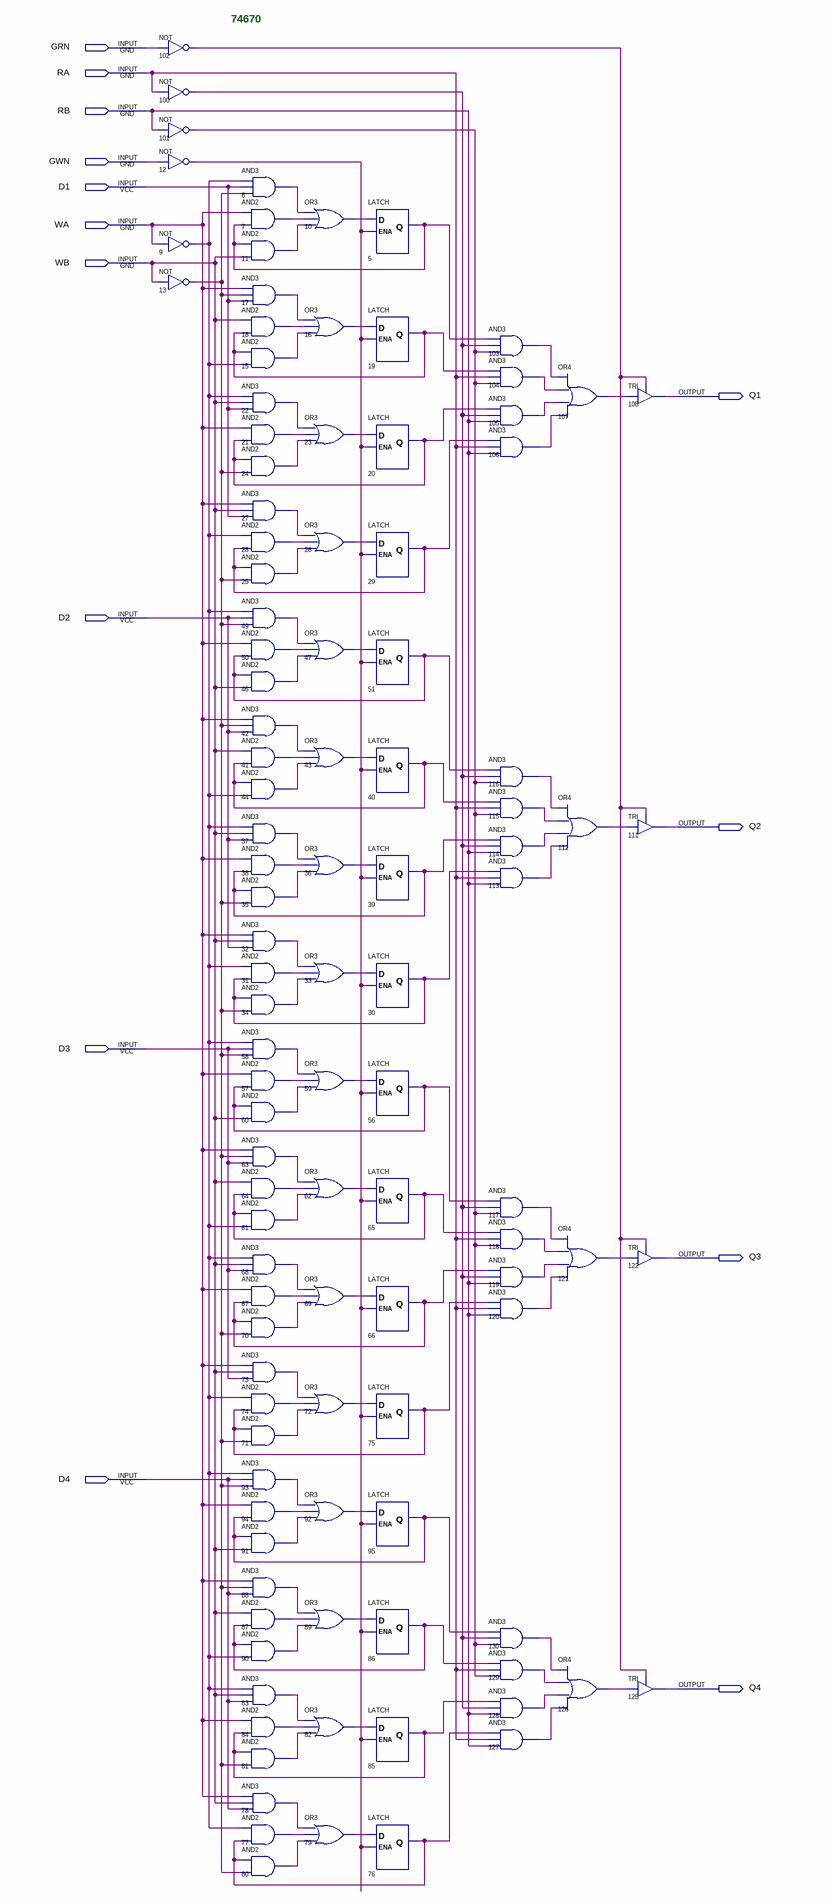
[diagram p0: schematic sheet]
// Quartus schematic 74670.bdf as structural Verilog: 110 symbols, 14 pins
module \74670  (
  input  GRN,
  input  RA,
  input  RB,
  input  GWN,
  input  D1,
  input  WA,
  input  WB,
  input  D2,
  input  D3,
  input  D4,
  output Q1,
  output Q2,
  output Q3,
  output Q4
);

  wire n5_q, n7_out, n8_out, n9_out, n10_out, n11_out, n12_out, n13_out, n15_out, n16_out, n17_out, n18_out,
       n19_q, n20_q, n21_out, n22_out, n23_out, n24_out, n25_out, n26_out, n27_out, n28_out, n29_q, n30_q,
       n31_out, n32_out, n33_out, n34_out, n35_out, n36_out, n37_out, n38_out, n39_q, n40_q, n41_out,
       n42_out, n43_out, n44_out, n46_out, n47_out, n49_out, n50_out, n51_q, n56_q, n57_out, n58_out,
       n59_out, n60_out, n61_out, n62_out, n63_out, n64_out, n65_q, n66_q, n67_out, n68_out, n69_out,
       n70_out, n71_out, n72_out, n73_out, n74_out, n75_q, n76_q, n77_out, n78_out, n79_out, n80_out,
       n81_out, n82_out, n83_out, n84_out, n85_q, n86_q, n87_out, n88_out, n89_out, n90_out, n91_out,
       n92_out, n93_out, n94_out, n95_q, n100_out, n101_out, n102_out, n103_out, n104_out, n105_out,
       n106_out, n107_out, n112_out, n113_out, n114_out, n115_out, n116_out, n117_out, n118_out, n119_out,
       n120_out, n121_out, n126_out, n127_out, n128_out, n129_out, n130_out;

  not u_102 (n102_out, GRN);
  not u_100 (n100_out, RA);
  not u_101 (n101_out, RB);
  not u_12 (n12_out, GWN);
  not u_9 (n9_out, WA);
  not u_13 (n13_out, WB);
  and u_8 (n8_out, n9_out, D1, n13_out);
  and u_7 (n7_out, WA, n5_q);
  and u_11 (n11_out, n5_q, WB);
  and u_17 (n17_out, WA, n13_out, D1);
  and u_18 (n18_out, WB, n19_q);
  and u_15 (n15_out, n19_q, n9_out);
  and u_22 (n22_out, n9_out, WB, D1);
  and u_21 (n21_out, WA, n20_q);
  and u_24 (n24_out, n20_q, n13_out);
  and u_27 (n27_out, WA, WB, D1);
  and u_28 (n28_out, n9_out, n29_q);
  and u_25 (n25_out, n29_q, n13_out);
  and u_49 (n49_out, n9_out, D2, n13_out);
  and u_50 (n50_out, WA, n51_q);
  and u_46 (n46_out, n51_q, WB);
  and u_42 (n42_out, WA, n13_out, D2);
  and u_41 (n41_out, WB, n40_q);
  and u_44 (n44_out, n40_q, n9_out);
  and u_37 (n37_out, n9_out, WB, D2);
  and u_38 (n38_out, WA, n39_q);
  and u_35 (n35_out, n39_q, n13_out);
  and u_32 (n32_out, WA, WB, D2);
  and u_31 (n31_out, n9_out, n30_q);
  and u_34 (n34_out, n30_q, n13_out);
  and u_58 (n58_out, n9_out, D3, n13_out);
  and u_57 (n57_out, WA, n56_q);
  and u_60 (n60_out, n56_q, WB);
  and u_63 (n63_out, WA, n13_out, D3);
  and u_64 (n64_out, WB, n65_q);
  and u_61 (n61_out, n65_q, n9_out);
  and u_68 (n68_out, n9_out, WB, D3);
  and u_67 (n67_out, WA, n66_q);
  and u_70 (n70_out, n66_q, n13_out);
  and u_73 (n73_out, WA, WB, D3);
  and u_74 (n74_out, n9_out, n75_q);
  and u_71 (n71_out, n75_q, n13_out);
  and u_93 (n93_out, n9_out, D4, n13_out);
  and u_94 (n94_out, WA, n95_q);
  and u_91 (n91_out, n95_q, WB);
  and u_88 (n88_out, WA, n13_out, D4);
  and u_87 (n87_out, WB, n86_q);
  and u_90 (n90_out, n86_q, n9_out);
  and u_83 (n83_out, n9_out, WB, D4);
  and u_84 (n84_out, WA, n85_q);
  and u_81 (n81_out, n85_q, n13_out);
  and u_78 (n78_out, WA, WB, D4);
  and u_77 (n77_out, n9_out, n76_q);
  and u_80 (n80_out, n76_q, n13_out);
  or u_10 (n10_out, n8_out, n7_out, n11_out);
  or u_16 (n16_out, n17_out, n18_out, n15_out);
  or u_23 (n23_out, n22_out, n21_out, n24_out);
  or u_26 (n26_out, n27_out, n28_out, n25_out);
  or u_47 (n47_out, n49_out, n50_out, n46_out);
  or u_43 (n43_out, n42_out, n41_out, n44_out);
  or u_36 (n36_out, n37_out, n38_out, n35_out);
  or u_33 (n33_out, n32_out, n31_out, n34_out);
  or u_59 (n59_out, n58_out, n57_out, n60_out);
  or u_62 (n62_out, n63_out, n64_out, n61_out);
  or u_69 (n69_out, n68_out, n67_out, n70_out);
  or u_72 (n72_out, n73_out, n74_out, n71_out);
  or u_92 (n92_out, n93_out, n94_out, n91_out);
  or u_89 (n89_out, n88_out, n87_out, n90_out);
  or u_82 (n82_out, n83_out, n84_out, n81_out);
  or u_79 (n79_out, n78_out, n77_out, n80_out);
  LATCH u_5 (.D(n10_out), .ENA(n12_out), .Q(n5_q));
  LATCH u_19 (.D(n16_out), .ENA(n12_out), .Q(n19_q));
  LATCH u_20 (.D(n23_out), .ENA(n12_out), .Q(n20_q));
  LATCH u_29 (.D(n26_out), .ENA(n12_out), .Q(n29_q));
  LATCH u_51 (.D(n47_out), .ENA(n12_out), .Q(n51_q));
  LATCH u_40 (.D(n43_out), .ENA(n12_out), .Q(n40_q));
  LATCH u_39 (.D(n36_out), .ENA(n12_out), .Q(n39_q));
  LATCH u_30 (.D(n33_out), .ENA(n12_out), .Q(n30_q));
  LATCH u_56 (.D(n59_out), .ENA(n12_out), .Q(n56_q));
  LATCH u_65 (.D(n62_out), .ENA(n12_out), .Q(n65_q));
  LATCH u_66 (.D(n69_out), .ENA(n12_out), .Q(n66_q));
  LATCH u_75 (.D(n72_out), .ENA(n12_out), .Q(n75_q));
  LATCH u_95 (.D(n92_out), .ENA(n12_out), .Q(n95_q));
  LATCH u_86 (.D(n89_out), .ENA(n12_out), .Q(n86_q));
  LATCH u_85 (.D(n82_out), .ENA(n12_out), .Q(n85_q));
  LATCH u_76 (.D(n79_out), .ENA(n12_out), .Q(n76_q));
  and u_103 (n103_out, n5_q, n100_out, n101_out);
  and u_104 (n104_out, n19_q, RA, n101_out);
  and u_105 (n105_out, n20_q, n100_out, RB);
  and u_106 (n106_out, n29_q, RA, RB);
  and u_116 (n116_out, n51_q, n100_out, n101_out);
  and u_115 (n115_out, n40_q, RA, n101_out);
  and u_114 (n114_out, n39_q, n100_out, RB);
  and u_113 (n113_out, n30_q, RA, RB);
  and u_117 (n117_out, n56_q, n100_out, n101_out);
  and u_118 (n118_out, n65_q, RA, n101_out);
  and u_119 (n119_out, n66_q, n100_out, RB);
  and u_120 (n120_out, n75_q, RA, RB);
  and u_130 (n130_out, n95_q, n100_out, n101_out);
  and u_129 (n129_out, n86_q, RA, n101_out);
  and u_128 (n128_out, n85_q, n100_out, RB);
  and u_127 (n127_out, n76_q, RA, RB);
  or u_107 (n107_out, n103_out, n104_out, n105_out, n106_out);
  or u_112 (n112_out, n116_out, n115_out, n114_out, n113_out);
  or u_121 (n121_out, n117_out, n118_out, n119_out, n120_out);
  or u_126 (n126_out, n130_out, n129_out, n128_out, n127_out);
  TRI u_108 (.IN(n107_out), .OE(n102_out), .OUT(Q1));
  TRI u_111 (.IN(n112_out), .OE(n102_out), .OUT(Q2));
  TRI u_122 (.IN(n121_out), .OE(n102_out), .OUT(Q3));
  TRI u_125 (.IN(n126_out), .OE(n102_out), .OUT(Q4));

  // Notes on the sheet:
  //   74670
endmodule
